# Altium project analog_io.PrjPCB
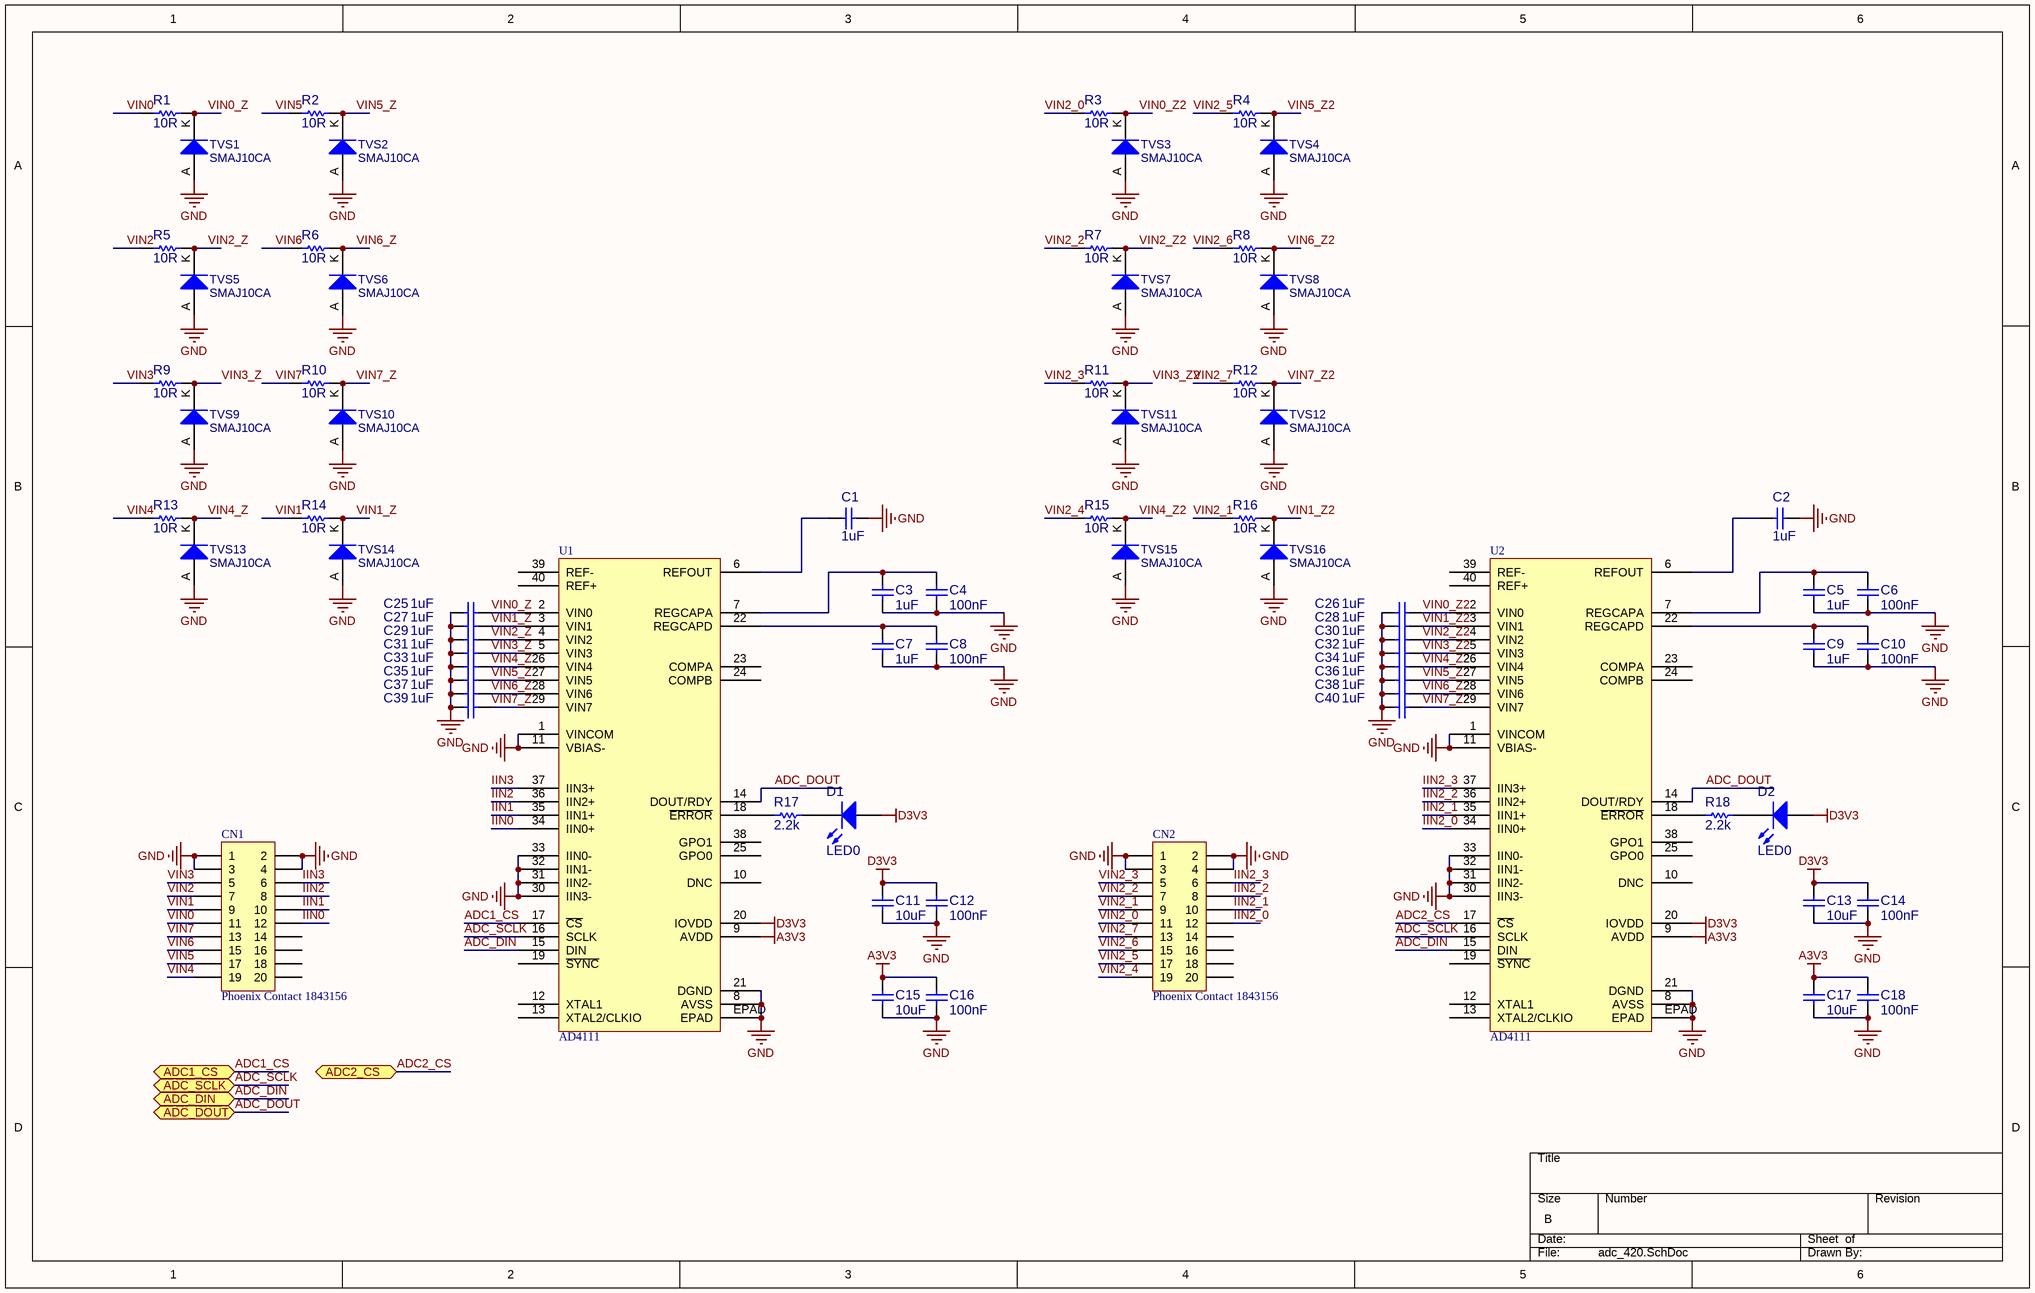
[diagram p0: adc_420.SchDoc]
4 sheets, 98 parts. Net scope: flat (ports and power ports of the same name join across sheets).
Board file: analog_io.PcbDoc
Sheets:
  adc_420.SchDoc
  analog_pwr.SchDoc
  dac.SchDoc
  aio_conn.SchDoc

## Sheet adc_420.SchDoc
size B

### Parts
C1  1uF  [C0603]
C2  1uF  [C0603]
C3  1uF  [C0603]
C4  100nF  [C0603]
C5  1uF  [C0603]
C6  100nF  [C0603]
C7  1uF  [C0603]
C8  100nF  [C0603]
C9  1uF  [C0603]
C10  100nF  [C0603]
C11  10uF  [C1206N]
C12  100nF  [C0603]
C13  10uF  [C1206N]
C14  100nF  [C0603]
C15  10uF  [C1206N]
C16  100nF  [C0603]
C17  10uF  [C1206N]
C18  100nF  [C0603]
C25  1uF  [C0603]
C26  1uF  [C0603]
C27  1uF  [C0603]
C28  1uF  [C0603]
C29  1uF  [C0603]
C30  1uF  [C0603]
C31  1uF  [C0603]
C32  1uF  [C0603]
C33  1uF  [C0603]
C34  1uF  [C0603]
C35  1uF  [C0603]
C36  1uF  [C0603]
C37  1uF  [C0603]
C38  1uF  [C0603]
C39  1uF  [C0603]
C40  1uF  [C0603]
CN1  Phoenix Contact 1843156  [PHOENIX1843156]
CN2  Phoenix Contact 1843156  [PHOENIX1843156]
D1  LED0  [LED0603]
D2  LED0  [LED0603]
R1  10R  [R0603]
R2  10R  [R0603]
R3  10R  [R0603]
R4  10R  [R0603]
R5  10R  [R0603]
R6  10R  [R0603]
R7  10R  [R0603]
R8  10R  [R0603]
R9  10R  [R0603]
R10  10R  [R0603]
R11  10R  [R0603]
R12  10R  [R0603]
R13  10R  [R0603]
R14  10R  [R0603]
R15  10R  [R0603]
R16  10R  [R0603]
R17  2.2k  [R0603]
R18  2.2k  [R0603]
TVS1  SMAJ10CA  [SMA]
TVS2  SMAJ10CA  [SMA]
TVS3  SMAJ10CA  [SMA]
TVS4  SMAJ10CA  [SMA]
TVS5  SMAJ10CA  [SMA]
TVS6  SMAJ10CA  [SMA]
TVS7  SMAJ10CA  [SMA]
TVS8  SMAJ10CA  [SMA]
TVS9  SMAJ10CA  [SMA]
TVS10  SMAJ10CA  [SMA]
TVS11  SMAJ10CA  [SMA]
TVS12  SMAJ10CA  [SMA]
TVS13  SMAJ10CA  [SMA]
TVS14  SMAJ10CA  [SMA]
TVS15  SMAJ10CA  [SMA]
TVS16  SMAJ10CA  [SMA]
U1  AD4111  [AD7119]
U2  AD4111  [AD7119]

### Ports
ADC1_CS, ADC2_CS, ADC_DIN, ADC_DOUT, ADC_SCLK

### Nets
A3V3: C15.1 C16.1 C17.1 C18.1 U1.9(AVDD) U2.9(AVDD)
D3V3: C11.1 C12.1 C13.1 C14.1 D1.1(A) D2.1(A) U1.20(IOVDD) U2.20(IOVDD)
GND: C1.2 C2.2 C3.2 C4.2 C5.2 C6.2 C7.2 C8.2 C9.2 C10.2 C11.2 C12.2 C13.2 C14.2 C15.2 C16.2 C17.2 C18.2 C25.1 C26.1 C27.1 C28.1 C29.1 C30.1 C31.1 C32.1 C33.1 C34.1 C35.1 C36.1 C37.1 C38.1 C39.1 C40.1 CN1.1 CN1.2 CN1.3 CN1.4 CN2.1 CN2.2 CN2.3 CN2.4 TVS1.A TVS2.A TVS3.A TVS4.A TVS5.A TVS6.A TVS7.A TVS8.A TVS9.A TVS10.A TVS11.A TVS12.A TVS13.A TVS14.A TVS15.A TVS16.A U1.1(VINCOM) U1.8(AVSS) U1.11(VBIAS-) U1.21(DGND) U1.30(IIN3-) U1.31(IIN2-) U1.32(IIN1-) U1.33(IIN0-) U1.EPAD U2.1(VINCOM) U2.8(AVSS) U2.11(VBIAS-) U2.21(DGND) U2.30(IIN3-) U2.31(IIN2-) U2.32(IIN1-) U2.33(IIN0-) U2.EPAD
ADC1_CS: U1.17(~{CS}) ; port ADC1_CS
ADC2_CS: U2.17(~{CS}) ; port ADC2_CS
ADC_DIN: U1.15(DIN) U2.15(DIN) ; port ADC_DIN
ADC_DOUT: U1.14(DOUT/RDY) U2.14(DOUT/RDY) ; port ADC_DOUT
ADC_SCLK: U1.16(SCLK) U2.16(SCLK) ; port ADC_SCLK
IIN0: CN1.12 U1.34(IIN0+)
IIN1: CN1.10 U1.35(IIN1+)
IIN2: CN1.8 U1.36(IIN2+)
IIN2_0: CN2.12 U2.34(IIN0+)
IIN2_1: CN2.10 U2.35(IIN1+)
IIN2_2: CN2.8 U2.36(IIN2+)
IIN2_3: CN2.6 U2.37(IIN3+)
IIN3: CN1.6 U1.37(IIN3+)
VIN0: CN1.11 R1.1
VIN0_Z: C25.2 R1.2 TVS1.K U1.2(VIN0)
VIN0_Z2: C26.2 R3.2 TVS3.K U2.2(VIN0)
VIN1: CN1.9 R14.1
VIN1_Z: C27.2 R14.2 TVS14.K U1.3(VIN1)
VIN1_Z2: C28.2 R16.2 TVS16.K U2.3(VIN1)
VIN2: CN1.7 R5.1
VIN2_0: CN2.11 R3.1
VIN2_1: CN2.9 R16.1
VIN2_2: CN2.7 R7.1
VIN2_3: CN2.5 R11.1
VIN2_4: CN2.19 R15.1
VIN2_5: CN2.17 R4.1
VIN2_6: CN2.15 R8.1
VIN2_7: CN2.13 R12.1
VIN2_Z: C29.2 R5.2 TVS5.K U1.4(VIN2)
VIN2_Z2: C30.2 R7.2 TVS7.K U2.4(VIN2)
VIN3: CN1.5 R9.1
VIN3_Z: C31.2 R9.2 TVS9.K U1.5(VIN3)
VIN3_Z2: C32.2 R11.2 TVS11.K U2.5(VIN3)
VIN4: CN1.19 R13.1
VIN4_Z: C33.2 R13.2 TVS13.K U1.26(VIN4)
VIN4_Z2: C34.2 R15.2 TVS15.K U2.26(VIN4)
VIN5: CN1.17 R2.1
VIN5_Z: C35.2 R2.2 TVS2.K U1.27(VIN5)
VIN5_Z2: C36.2 R4.2 TVS4.K U2.27(VIN5)
VIN6: CN1.15 R6.1
VIN6_Z: C37.2 R6.2 TVS6.K U1.28(VIN6)
VIN6_Z2: C38.2 R8.2 TVS8.K U2.28(VIN6)
VIN7: CN1.13 R10.1
VIN7_Z: C39.2 R10.2 TVS10.K U1.29(VIN7)
VIN7_Z2: C40.2 R12.2 TVS12.K U2.29(VIN7)
NetC1_1: C1.1 U1.6(REFOUT)
NetC2_1: C2.1 U2.6(REFOUT)
NetC3_1: C3.1 C4.1 U1.7(REGCAPA)
NetC5_1: C5.1 C6.1 U2.7(REGCAPA)
NetC7_1: C7.1 C8.1 U1.22(REGCAPD)
NetC9_1: C9.1 C10.1 U2.22(REGCAPD)
NetD1_2: D1.2(K) R17.2
NetD2_2: D2.2(K) R18.2
NetR17_1: R17.1 U1.18(~{ERROR})
NetR18_1: R18.1 U2.18(~{ERROR})

Not connected (* = marked no-connect by the designer): CN1 14 16 18 20; CN2 14 16 18 20; U1 10(DNC) 12(XTAL1) 13(XTAL2/CLKIO) 19(~{SYNC}) 23(COMPA) 24(COMPB) 25(GPO0) 38(GPO1) 39(REF-) 40(REF+); U2 10(DNC) 12(XTAL1) 13(XTAL2/CLKIO) 19(~{SYNC}) 23(COMPA) 24(COMPB) 25(GPO0) 38(GPO1) 39(REF-) 40(REF+)

### Library data of the parts
C1-C3 C5 C7 C9 C11 C13 C15 C17 C25-C40 = Cap: Capacitor; Published: 8-Jun-2000; LatestRevisionDate: 17-Jul-2002; LatestRevisionNote: Re-released for DXP Platform.; PackageReference: RAD-0.3; Publisher: Altium Limited; PackageDescription: Radial Cap, Thru-Hole; 2 Leads; 0.3 in Pin Spacing
C4 C6 C8 C10 C12 C14 C16 C18 = Cap: GRM155R71C104KA88J; Published: 8-Jun-2000; LatestRevisionDate: 17-Jul-2002; LatestRevisionNote: Re-released for DXP Platform.; PackageReference: RAD-0.3; Publisher: Altium Limited; PackageDescription: Radial Cap, Thru-Hole; 2 Leads; 0.3 in Pin Spacing
CN1 CN2 = Header 10X2: Header, 10-Pin, Dual row; LatestRevisionDate: 17-Jul-2002; LatestRevisionNote: Re-released for DXP Platform.; Publisher: Altium Limited
D1 D2 = LED0: Typical INFRARED GaAs LED; Published: 8-Jun-2000; LatestRevisionDate: 08-Jul-2005; LatestRevisionNote: Mech Layer 1 removed.; PackageReference: LED-0; Publisher: Altium Limited; PackageDescription: LED; 2 Leads
R1-R18 = Res1: Resistor; Published: 8-Jun-2000; LatestRevisionDate: 17-Jul-2002; LatestRevisionNote: Re-released for DXP Platform.; PackageReference: AXIAL-0.3; Publisher: Altium Limited; PackageDescription: Axial Device, Thru-Hole; 2 Leads; 0.3 in Pin Spacing
TVS1-TVS16 = DIODE: pin to pad: A>1 K>2

## Sheet analog_pwr.SchDoc
size B
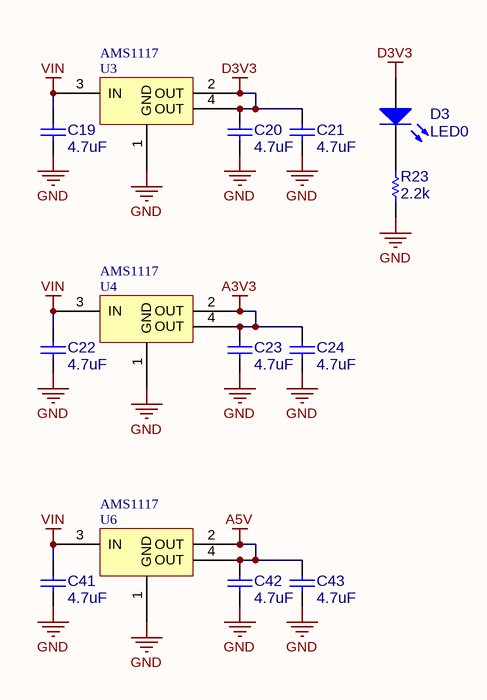
[diagram p1: analog_pwr.SchDoc]

### Parts
C19  4.7uF  [TANT_B]
C20  4.7uF  [C0603]
C21  4.7uF  [TANT_B]
C22  4.7uF  [TANT_B]
C23  4.7uF  [C0603]
C24  4.7uF  [TANT_B]
C41  4.7uF  [TANT_B]
C42  4.7uF  [C0603]
C43  4.7uF  [TANT_B]
D3  LED0  [LED0603]
R23  2.2k  [R0603]
U3  AMS1117  [SOT223]
U4  AMS1117  [SOT223]
U6  AMS1117  [SOT223]

### Nets
A3V3: C23.1 C24.1 U4.2(OUT) U4.4(OUT)
A5V: C42.1 C43.1 U6.2(OUT) U6.4(OUT)
D3V3: C20.1 C21.1 D3.1(A) U3.2(OUT) U3.4(OUT)
GND: C19.2 C20.2 C21.2 C22.2 C23.2 C24.2 C41.2 C42.2 C43.2 R23.1 U3.1(GND) U4.1(GND) U6.1(GND)
VIN: C19.1 C22.1 C41.1 U3.3(IN) U4.3(IN) U6.3(IN)
NetD3_2: D3.2(K) R23.2

### Library data of the parts
C19-C24 C41-C43 = Cap: Capacitor; Published: 8-Jun-2000; LatestRevisionDate: 17-Jul-2002; LatestRevisionNote: Re-released for DXP Platform.; PackageReference: RAD-0.3; Publisher: Altium Limited; PackageDescription: Radial Cap, Thru-Hole; 2 Leads; 0.3 in Pin Spacing
D3 = LED0: Typical INFRARED GaAs LED; Published: 8-Jun-2000; LatestRevisionDate: 08-Jul-2005; LatestRevisionNote: Mech Layer 1 removed.; PackageReference: LED-0; Publisher: Altium Limited; PackageDescription: LED; 2 Leads
R23 = Res1: Resistor; Published: 8-Jun-2000; LatestRevisionDate: 17-Jul-2002; LatestRevisionNote: Re-released for DXP Platform.; PackageReference: AXIAL-0.3; Publisher: Altium Limited; PackageDescription: Axial Device, Thru-Hole; 2 Leads; 0.3 in Pin Spacing

## Sheet dac.SchDoc
size A
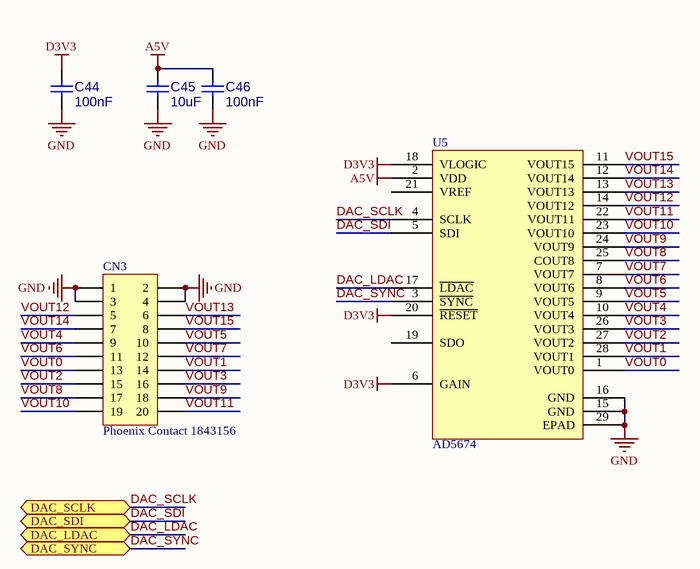
[diagram p2: dac.SchDoc]

### Parts
C44  100nF  [C0603]
C45  10uF  [C1206N]
C46  100nF  [C0603]
CN3  Phoenix Contact 1843156  [PHOENIX1843156]
U5  AD5674  [PNI-MAGI2C]

### Ports
DAC_LDAC, DAC_SCLK, DAC_SDI, DAC_SYNC

### Nets
A5V: C45.1 C46.1 U5.2(VDD)
D3V3: C44.1 U5.6(GAIN) U5.18(VLOGIC) U5.20(~{RESET})
GND: C44.2 C45.2 C46.2 CN3.1 CN3.2 CN3.3 CN3.4 U5.15(GND) U5.16(GND) U5.29(EPAD)
DAC_LDAC: U5.17(~{LDAC}) ; port DAC_LDAC
DAC_SCLK: U5.4(SCLK) ; port DAC_SCLK
DAC_SDI: U5.5(SDI) ; port DAC_SDI
DAC_SYNC: U5.3(~{SYNC}) ; port DAC_SYNC
VOUT0: CN3.13 U5.1(VOUT0)
VOUT1: CN3.14 U5.28(VOUT1)
VOUT2: CN3.15 U5.27(VOUT2)
VOUT3: CN3.16 U5.26(VOUT3)
VOUT4: CN3.9 U5.10(VOUT4)
VOUT5: CN3.10 U5.9(VOUT5)
VOUT6: CN3.11 U5.8(VOUT6)
VOUT7: CN3.12 U5.7(VOUT7)
VOUT8: CN3.17 U5.25(COUT8)
VOUT9: CN3.18 U5.24(VOUT9)
VOUT10: CN3.19 U5.23(VOUT10)
VOUT11: CN3.20 U5.22(VOUT11)
VOUT12: CN3.5 U5.14(VOUT12)
VOUT13: CN3.6 U5.13(VOUT13)
VOUT14: CN3.7 U5.12(VOUT14)
VOUT15: CN3.8 U5.11(VOUT15)

Not connected (* = marked no-connect by the designer): U5 19(SDO) 21(VREF)

### Library data of the parts
C44 C46 = Cap: GRM155R71C104KA88J; Published: 8-Jun-2000; LatestRevisionDate: 17-Jul-2002; LatestRevisionNote: Re-released for DXP Platform.; PackageReference: RAD-0.3; Publisher: Altium Limited; PackageDescription: Radial Cap, Thru-Hole; 2 Leads; 0.3 in Pin Spacing
C45 = Cap: Capacitor; Published: 8-Jun-2000; LatestRevisionDate: 17-Jul-2002; LatestRevisionNote: Re-released for DXP Platform.; PackageReference: RAD-0.3; Publisher: Altium Limited; PackageDescription: Radial Cap, Thru-Hole; 2 Leads; 0.3 in Pin Spacing
CN3 = Header 10X2: Header, 10-Pin, Dual row; LatestRevisionDate: 17-Jul-2002; LatestRevisionNote: Re-released for DXP Platform.; Publisher: Altium Limited

## Sheet aio_conn.SchDoc
size A
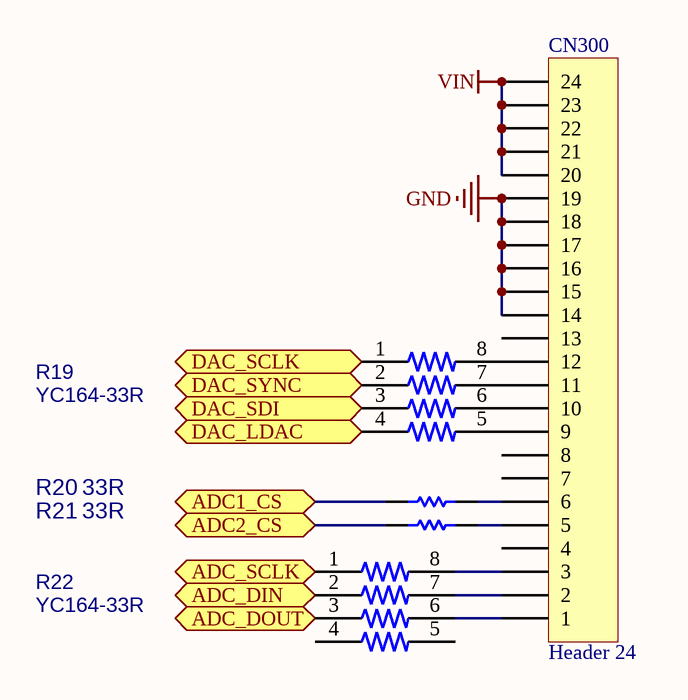
[diagram p3: aio_conn.SchDoc]

### Parts
CN300  Header 24  [FPC-0.5-24]
R19  YC164-33R  [YC164]
R20  33R  [R0603]
R21  33R  [R0603]
R22  YC164-33R  [YC164]

### Ports
ADC1_CS, ADC2_CS, ADC_DIN, ADC_DOUT, ADC_SCLK, DAC_LDAC, DAC_SCLK, DAC_SDI, DAC_SYNC

### Nets
GND: CN300.14 CN300.15 CN300.16 CN300.17 CN300.18 CN300.19
VIN: CN300.20 CN300.21 CN300.22 CN300.23 CN300.24
ADC1_CS: R20.2 ; port ADC1_CS
ADC2_CS: R21.2 ; port ADC2_CS
ADC_DIN: R22.2 ; port ADC_DIN
ADC_DOUT: R22.3 ; port ADC_DOUT
ADC_SCLK: R22.1 ; port ADC_SCLK
DAC_LDAC: R19.4 ; port DAC_LDAC
DAC_SCLK: R19.1 ; port DAC_SCLK
DAC_SDI: R19.3 ; port DAC_SDI
DAC_SYNC: R19.2 ; port DAC_SYNC
NetCN300_1: CN300.1 R22.6
NetCN300_2: CN300.2 R22.7
NetCN300_3: CN300.3 R22.8
NetCN300_5: CN300.5 R21.1
NetCN300_6: CN300.6 R20.1
NetCN300_9: CN300.9 R19.5
NetCN300_10: CN300.10 R19.6
NetCN300_11: CN300.11 R19.7
NetCN300_12: CN300.12 R19.8

Not connected (* = marked no-connect by the designer): CN300 4 7 8 13; R22 4 5

### Library data of the parts
CN300 = Header 24: Header, 24-Pin; LatestRevisionDate: 17-Jul-2002; LatestRevisionNote: Re-released for DXP Platform.; Publisher: Altium Limited
R19 R22 = YC164
R20 R21 = Res1: Resistor; Published: 8-Jun-2000; LatestRevisionDate: 17-Jul-2002; LatestRevisionNote: Re-released for DXP Platform.; PackageReference: AXIAL-0.3; Publisher: Altium Limited; PackageDescription: Axial Device, Thru-Hole; 2 Leads; 0.3 in Pin Spacing

## Nets that join several sheets
A3V3: adc_420 (6 pins), analog_pwr (C23.1 C24.1 U4.2 U4.4)
A5V: analog_pwr (C42.1 C43.1 U6.2 U6.4), dac (C45.1 C46.1 U5.2)
D3V3: adc_420 (8 pins), analog_pwr (5 pins), dac (C44.1 U5.6 U5.18 U5.20)
GND: adc_420 (76 pins), analog_pwr (13 pins), dac (10 pins), aio_conn (6 pins)
VIN: analog_pwr (6 pins), aio_conn (5 pins)
ADC1_CS: adc_420 (U1.17), aio_conn (R20.2)
ADC2_CS: adc_420 (U2.17), aio_conn (R21.2)
ADC_DIN: adc_420 (U1.15 U2.15), aio_conn (R22.2)
ADC_DOUT: adc_420 (U1.14 U2.14), aio_conn (R22.3)
ADC_SCLK: adc_420 (U1.16 U2.16), aio_conn (R22.1)
DAC_LDAC: dac (U5.17), aio_conn (R19.4)
DAC_SCLK: dac (U5.4), aio_conn (R19.1)
DAC_SDI: dac (U5.5), aio_conn (R19.3)
DAC_SYNC: dac (U5.3), aio_conn (R19.2)